# EAGLE design Payload_Power_Board (EAGLE 9.5.1)
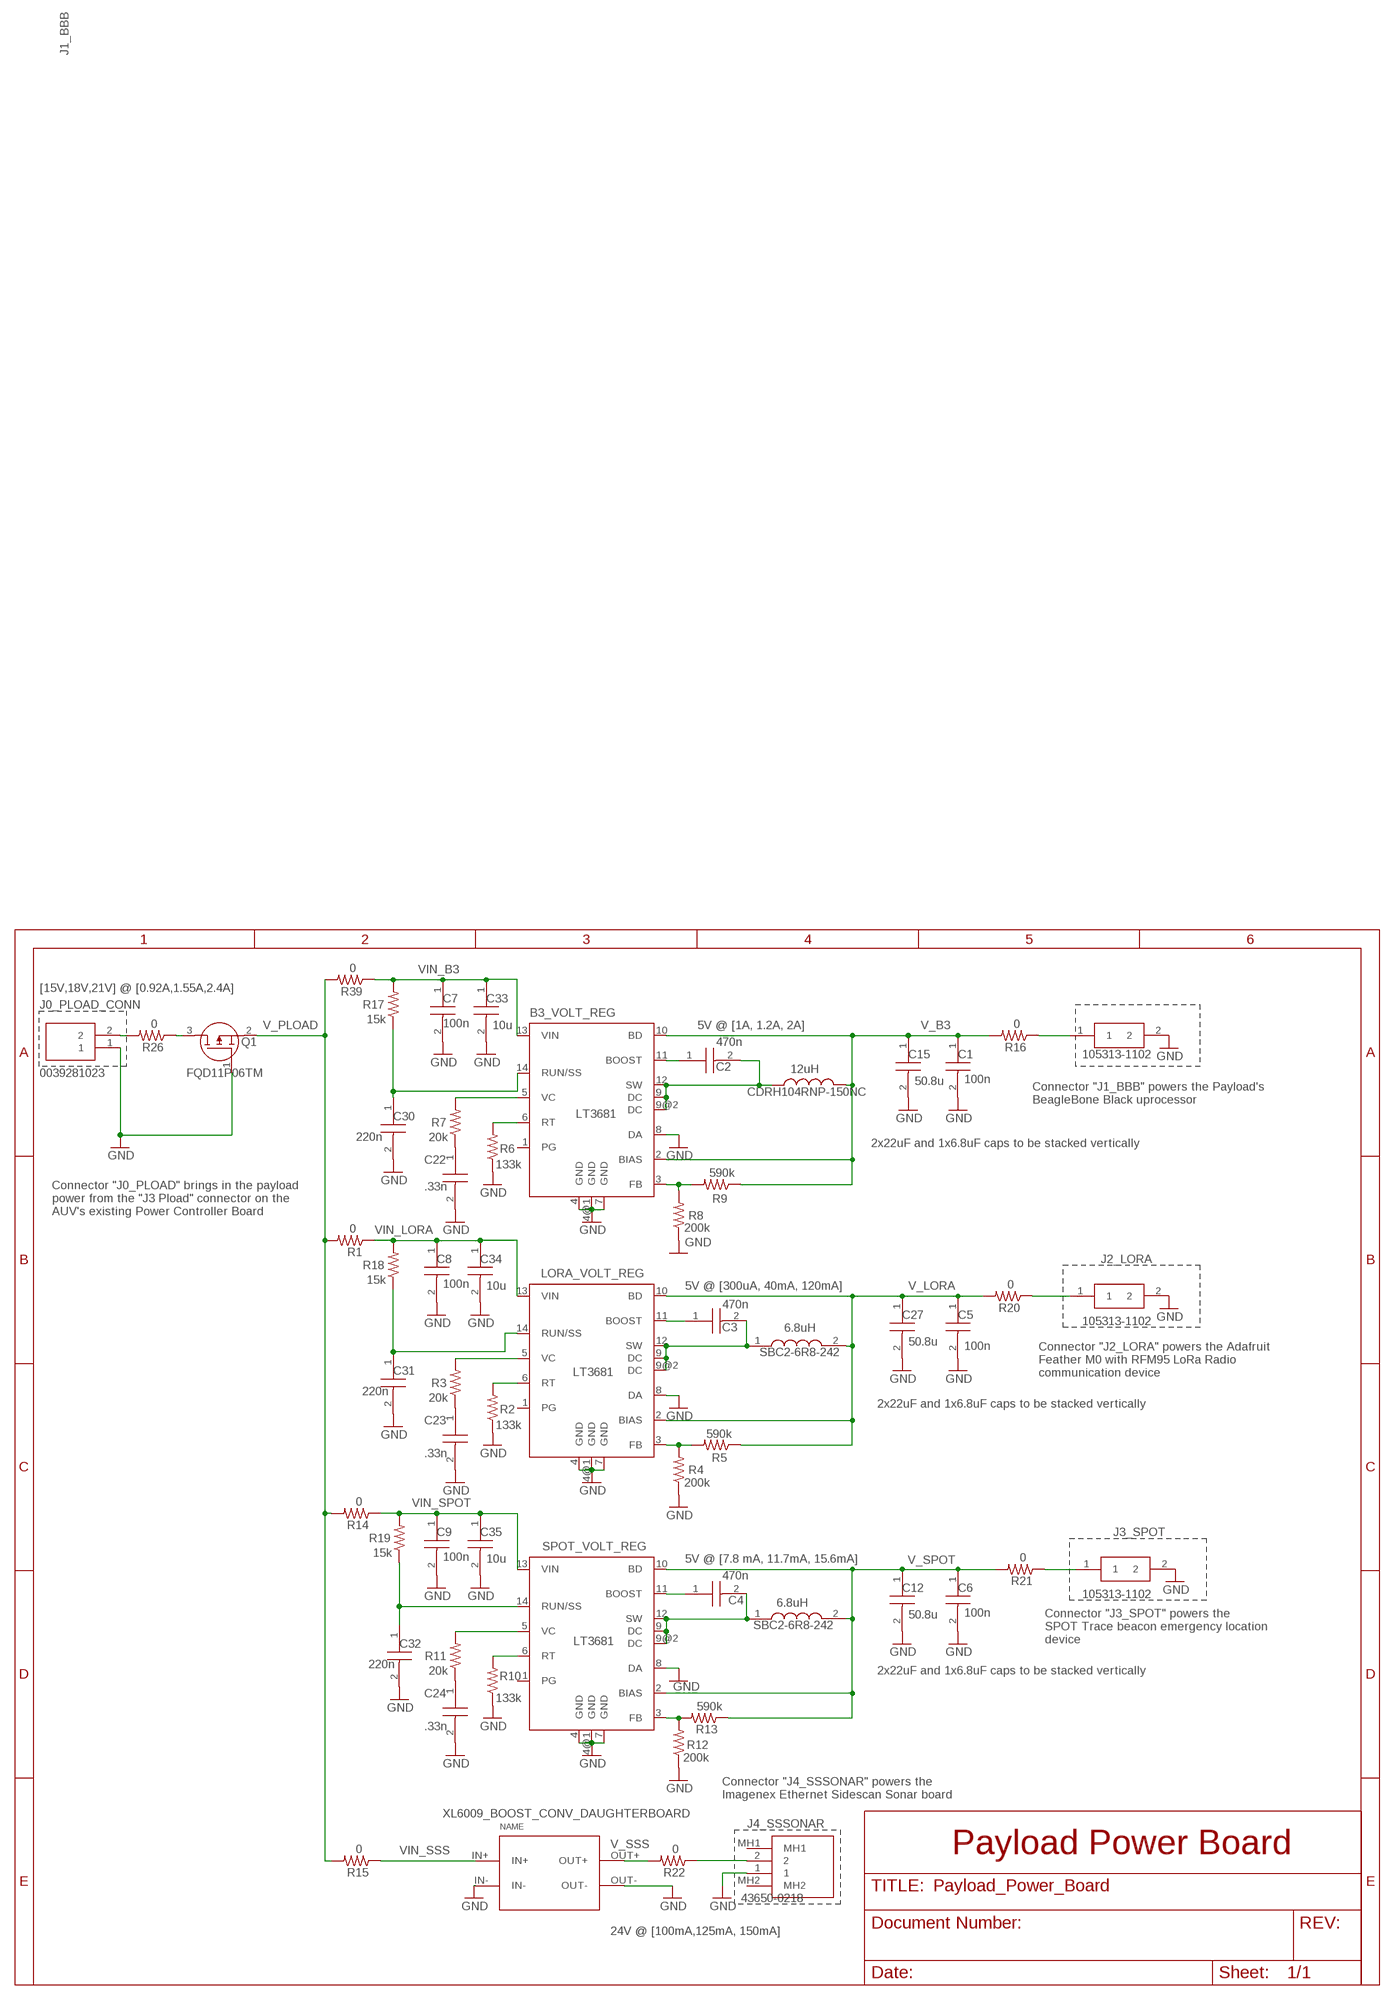
[diagram p0: schematic, sheet 1]

## Parts
B3_VOLT_REG  LT3681  [DFN14-4X3DE]
C1  100n  06033C104KAT4A  [CAPC1608X90N]
C2  470n  06033C474JAT2A  [CAPC1608X90N]
C3  470n  06033C474JAT2A  [CAPC1608X90N]
C4  470n  06033C474JAT2A  [CAPC1608X90N]
C5  100n  06033C104KAT4A  [CAPC1608X90N]
C6  100n  06033C104KAT4A  [CAPC1608X90N]
C7  100n  06031C104KAT2A  [CAPC1608X90N]
C8  100n  06031C104KAT2A  [CAPC1608X90N]
C9  100n  06031C104KAT2A  [CAPC1608X90N]
C12  50.8u  12103C226KAT2A  [CAPC3225X279N]
C15  50.8u  12103C226KAT2A  [CAPC3225X279N]
C22  .33n  08053C334KAT2A  [CAPC2012X140N]
C23  .33n  08053C334KAT2A  [CAPC2012X140N]
C24  .33n  08053C334KAT2A  [CAPC2012X140N]
C27  50.8u  12103C226KAT2A  [CAPC3225X279N]
C30  220n  08051C224KAT2A  [CAPC2012X140N]
C31  220n  08051C224KAT2A  [CAPC2012X140N]
C32  220n  08051C224KAT2A  [CAPC2012X140N]
C33  10u  22201C106KAT2A  [CAPC5750X279N]
C34  10u  22201C106KAT2A  [CAPC5750X279N]
C35  10u  22201C106KAT2A  [CAPC5750X279N]
INDUCTOR_3  CDRH104RNP-150NC  [INDPM102100X400N]
J0_PLOAD_CONN  0039281023  [SHDR2W145P0X550_1X2_960X540X13]
J1_BBB  105313-1102  [1053131102]
J2_LORA  105313-1102  [1053131102]
J3_SPOT  105313-1102  [1053131102]
J4_SSSONAR  43650-0218  [436500218]
L4  SBC2-6R8-242  [SBC26R8242]
L5  SBC2-6R8-242  [SBC26R8242]
LORA_VOLT_REG  LT3681  [DFN14-4X3DE]
Q1  FQD11P06TM  [DPAK3-CASE-369AS]
R1  0  R-US_0207/2V  [0207/2V]
R2  133k  R-US_R0603  [R0603]
R3  20k  R-US_R0603  [R0603]
R4  200k  R-US_R0603  [R0603]
R5  590k  R-US_R0603  [R0603]
R6  133k  R-US_R0603  [R0603]
R7  20k  R-US_R0603  [R0603]
R8  200k  R-US_R0603  [R0603]
R9  590k  R-US_R0603  [R0603]
R10  133k  R-US_R0603  [R0603]
R11  20k  R-US_R0603  [R0603]
R12  200k  R-US_R0603  [R0603]
R13  590k  R-US_R0603  [R0603]
R14  0  R-US_0207/2V  [0207/2V]
R15  0  R-US_0207/2V  [0207/2V]
R16  0  R-US_0207/2V  [0207/2V]
R17  15k  R-US_R0603  [R0603]
R18  15k  R-US_R0603  [R0603]
R19  15k  R-US_R0603  [R0603]
R20  0  R-US_0207/2V  [0207/2V]
R21  0  R-US_0207/2V  [0207/2V]
R22  0  R-US_0207/2V  [0207/2V]
R26  0  R-US_0207/2V  [0207/2V]
R39  0  R-US_0207/2V  [0207/2V]
SPOT_VOLT_REG  LT3681  [DFN14-4X3DE]
XL6009_BOOST_CONV_DAUGHTERBOARD  XL6009  CP8-ADJ  [CP8-ADJ]

## Nets
CBOOST_B3: B3_VOLT_REG.11(BOOST) C2.1
CBOOST_LORA: C3.1 LORA_VOLT_REG.11(BOOST)
CBOOST_SPOT: C4.1 SPOT_VOLT_REG.11(BOOST)
FB_B3: B3_VOLT_REG.3(FB) R8.2 R9.2
FB_LORA: LORA_VOLT_REG.3(FB) R4.2 R5.2
FB_SPOT: R12.2 R13.2 SPOT_VOLT_REG.3(FB)
GND: B3_VOLT_REG.4(GND) B3_VOLT_REG.4@1(GND) B3_VOLT_REG.7(GND) B3_VOLT_REG.8(DA) C1.2 C5.2 C6.2 C7.2 C8.2 C9.2 C12.2 C15.2 C22.2 C23.2 C24.2 C27.2 C30.2 C31.2 C32.2 C33.2 C34.2 C35.2 J0_PLOAD_CONN.1 J1_BBB.2 J2_LORA.2 J3_SPOT.2 J4_SSSONAR.1 LORA_VOLT_REG.4(GND) LORA_VOLT_REG.4@1(GND) LORA_VOLT_REG.7(GND) LORA_VOLT_REG.8(DA) Q1.1(G) R2.1 R4.1 R6.1 R8.1 R10.1 R12.1 SPOT_VOLT_REG.4(GND) SPOT_VOLT_REG.4@1(GND) SPOT_VOLT_REG.7(GND) SPOT_VOLT_REG.8(DA) XL6009_BOOST_CONV_DAUGHTERBOARD.IN- XL6009_BOOST_CONV_DAUGHTERBOARD.OUT-
N$1: C22.1 R7.1
N$2: C23.1 R3.1
N$4: C24.1 R11.1
RT_B3: B3_VOLT_REG.6(RT) R6.2
RT_LORA: LORA_VOLT_REG.6(RT) R2.2
RT_SPOT: R10.2 SPOT_VOLT_REG.6(RT)
RUN/SS_B3: B3_VOLT_REG.14(RUN/SS) C30.1 R17.1
RUN/SS_LORA: C31.1 LORA_VOLT_REG.14(RUN/SS) R18.1
RUN/SS_SPOT: C32.1 R19.1 SPOT_VOLT_REG.14(RUN/SS)
SW_B3: B3_VOLT_REG.9(DC) B3_VOLT_REG.9@2(DC) B3_VOLT_REG.12(SW) C2.2 INDUCTOR_3.1
SW_LORA: C3.2 L5.1 LORA_VOLT_REG.9(DC) LORA_VOLT_REG.9@2(DC) LORA_VOLT_REG.12(SW)
SW_SPOT: C4.2 L4.1 SPOT_VOLT_REG.9(DC) SPOT_VOLT_REG.9@2(DC) SPOT_VOLT_REG.12(SW)
V_B3: B3_VOLT_REG.2(BIAS) B3_VOLT_REG.10(BD) C1.1 C15.1 INDUCTOR_3.2 R9.1 R16.2
V_B31: J1_BBB.1 R16.1
V_LORA: C5.1 C27.1 L5.2 LORA_VOLT_REG.2(BIAS) LORA_VOLT_REG.10(BD) R5.1 R20.2
V_LORA1: J2_LORA.1 R20.1
V_PLOAD: Q1.2(S) R1.2 R14.2 R15.2 R39.2
V_PLOAD0: Q1.3(D) R26.1
V_PLOAD00: J0_PLOAD_CONN.2 R26.2
V_SPOT: C6.1 C12.1 L4.2 R13.1 R21.2 SPOT_VOLT_REG.2(BIAS) SPOT_VOLT_REG.10(BD)
V_SPOT1: J3_SPOT.1 R21.1
V_SSS: R22.2 XL6009_BOOST_CONV_DAUGHTERBOARD.OUT+
V_SSS1: J4_SSSONAR.2 R22.1
VC_B3: B3_VOLT_REG.5(VC) R7.2
VC_LORA: LORA_VOLT_REG.5(VC) R3.2
VC_SPOT: R11.2 SPOT_VOLT_REG.5(VC)
VIN_B3: B3_VOLT_REG.13(VIN) C7.1 C33.1 R17.2 R39.1
VIN_LORA: C8.1 C34.1 LORA_VOLT_REG.13(VIN) R1.1 R18.2
VIN_SPOT: C9.1 C35.1 R14.1 R19.2 SPOT_VOLT_REG.13(VIN)
VIN_SSS: R15.1 XL6009_BOOST_CONV_DAUGHTERBOARD.IN+
Unconnected: B3_VOLT_REG.1(PG) J4_SSSONAR.MH1 J4_SSSONAR.MH2 LORA_VOLT_REG.1(PG) SPOT_VOLT_REG.1(PG)

## Notes on the sheet
- [15V,18V,21V] @ [0.92A,1.55A,2.4A]
- 10u | 5V @ [1A, 1.2A, 2A]
- 12uH
- 50.8u
- Connector "J1_BBB" powers the Payload's
  BeagleBone Black uprocessor
- 220n
- 2x22uF and 1x6.8uF caps to be stacked vertically
- .33n
- Connector "J0_PLOAD" brings in the payload
  power from the "J3 Pload" connector on the 
  AUV's existing Power Controller Board
- 10u | 5V @ [300uA, 40mA, 120mA]
- 470n
- 6.8uH
- 50.8u
- Connector "J2_LORA" powers the Adafruit
  Feather M0 with RFM95 LoRa Radio 
  communication device
- 220n
- 2x22uF and 1x6.8uF caps to be stacked vertically
- .33n
- 10u | 5V @ [7.8 mA, 11.7mA, 15.6mA]
- 6.8uH
- 50.8u
- Connector "J3_SPOT" powers the
  SPOT Trace beacon emergency location
  device
- 220n
- 2x22uF and 1x6.8uF caps to be stacked vertically
- .33n
- Connector "J4_SSSONAR" powers the
  Imagenex Ethernet Sidescan Sonar board
- XL6009_BOOST_CONV_DAUGHTERBOARD
- Payload Power Board
- 24V @ [100mA,125mA, 150mA]

## Library data of the parts
B3_VOLT_REG LORA_VOLT_REG SPOT_VOLT_REG = linear-technology:LT3681: 36V, 2A, 2.8MHz Step-Down Switching Regulator with Integrated Power Schottky Diode Source: http://www.linear.com/pc/downloadDocument.do?navId=H0,C1,C1003,C1042,C1032,C1064,P38040,D25144; MPN: LT3681EDE#PBF; OC_FARNELL: 1627603; OC_NEWARK: 57M8550
C1 C5 C6 = 06033C104KAT4A:06033C104KAT4A: Multilayer Ceramic Capacitors MLCC - SMD/SMT 25volts 0.1uF 10% X7R Source: Datasheet <http://www.mouser.com/catalog/supplier/library/pdf/AVXSurfaceMountCeramic.pdf>; DESCRIPTION: Multilayer Ceramic Capacitors MLCC - SMD/SMT 25volts 0.1uF 10% X7R; HEIGHT: 0.9mm; MANUFACTURER_NAME: AVX; MANUFACTURER_PART_NUMBER: 06033C104KAT4A; MOUSER_PART_NUMBER: 581-06033C104KAT4A; MOUSER_PRICE-STOCK: https://www.mouser.com/Search/Refine.aspx?Keyword=581-06033C104KAT4A
C2-C4 = 06033C474JAT2A:06033C474JAT2A: Multilayer Ceramic Capacitors MLCC - SMD/SMT 25V 470nF X7R 0603 +5% Source: Datasheet <https://componentsearchengine.com/Datasheets/1/06031A100FAT2A.pdf>; DESCRIPTION: Multilayer Ceramic Capacitors MLCC - SMD/SMT 25V 470nF X7R 0603 +5%; HEIGHT: 0.9mm; MANUFACTURER_NAME: AVX; MANUFACTURER_PART_NUMBER: 06033C474JAT2A; MOUSER_PART_NUMBER: 581-06033C474JAT2A; MOUSER_PRICE-STOCK: https://www.mouser.com/Search/Refine.aspx?Keyword=581-06033C474JAT2A
C7-C9 = 06031C104KAT2A:06031C104KAT2A: AVX - 06031C104KAT2A - CAP, MLCC, X7R, 0.1UF, 100V, 0603 Source: Datasheet <https://componentsearchengine.com/Datasheets/1/06031A100FAT2A.pdf>; DESCRIPTION: AVX - 06031C104KAT2A - CAP, MLCC, X7R, 0.1UF, 100V, 0603; HEIGHT: 0.9mm; MANUFACTURER_NAME: AVX; MANUFACTURER_PART_NUMBER: 06031C104KAT2A; MOUSER_PART_NUMBER: 581-06031C104KAT2A; MOUSER_PRICE-STOCK: https://www.mouser.com/Search/Refine.aspx?Keyword=581-06031C104KAT2A
C12 C15 C27 = 12103C226KAT2A:12103C226KAT2A: Multilayer Ceramic Capacitors MLCC - SMD/SMT 25V 22uF X7R 1210 0.1 Source: Datasheet <https://componentsearchengine.com/Datasheets/1/12103C226KAT2A.pdf>; DESCRIPTION: Multilayer Ceramic Capacitors MLCC - SMD/SMT 25V 22uF X7R 1210 0.1; HEIGHT: 2.79mm; MANUFACTURER_NAME: AVX; MANUFACTURER_PART_NUMBER: 12103C226KAT2A; MOUSER_PART_NUMBER: 581-12103C226KAT2A; MOUSER_PRICE-STOCK: https://www.mouser.com/Search/Refine.aspx?Keyword=581-12103C226KAT2A
C22-C24 = 08053C334KAT2A:08053C334KAT2A: AVX 0805 Standard 0.33uF Ceramic Multilayer Capacitor, 25 V dc, +125 Source: Datasheet <http://datasheets.avx.com/X7RDielectric.pdf>; DESCRIPTION: AVX 0805 Standard 0.33uF Ceramic Multilayer Capacitor, 25 V dc, +125; HEIGHT: 1.4mm; MANUFACTURER_NAME: AVX; MANUFACTURER_PART_NUMBER: 08053C334KAT2A; MOUSER_PART_NUMBER: 581-08053C334KAT2A; MOUSER_PRICE-STOCK: https://www.mouser.com/Search/Refine.aspx?Keyword=581-08053C334KAT2A; RS_PART_NUMBER: 1747387; RS_PRICE-STOCK: http://uk.rs-online.com/web/p/products/1747387
C30-C32 = 08051C224KAT2A:08051C224KAT2A: Cap Ceramic 0.22uF 100V X7R 10% Pad SMD 0805 125C T/R Source: Datasheet <https://www.mouser.com/datasheet/2/40/X7RDielectric-777024.pdf>; DESCRIPTION: Cap Ceramic 0.22uF 100V X7R 10% Pad SMD 0805 125C T/R; HEIGHT: 1.4mm; MANUFACTURER_NAME: AVX; MANUFACTURER_PART_NUMBER: 08051C224KAT2A; MOUSER_PART_NUMBER: 581-08051C224KAT2A; MOUSER_PRICE-STOCK: https://www.mouser.com/Search/Refine.aspx?Keyword=581-08051C224KAT2A
C33-C35 = 22201C106KAT2A:22201C106KAT2A: Cap Ceramic 10uF 100V X7R 10% Pad SMD 2220 125C T/R Source: Datasheet <https://www.mouser.com/datasheet/2/40/X7RDielectric-777024.pdf>; DESCRIPTION: Cap Ceramic 10uF 100V X7R 10% Pad SMD 2220 125C T/R; HEIGHT: 2.79mm; MANUFACTURER_NAME: AVX; MANUFACTURER_PART_NUMBER: 22201C106KAT2A; MOUSER_PART_NUMBER: 581-22201C106KAT2A; MOUSER_PRICE-STOCK: https://www.mouser.com/Search/Refine.aspx?Keyword=581-22201C106KAT2A
INDUCTOR_3 = CDRH104RNP-150NC:CDRH104RNP-150NC: Fixed Inductors 15uH 3.1A Source: Datasheet <http://products.sumida.com/products/pdf/CDRH104R.pdf>; DESCRIPTION: Fixed Inductors 15uH 3.1A; HEIGHT: 4mm; MANUFACTURER_NAME: Sumida; MANUFACTURER_PART_NUMBER: CDRH104RNP-150NC; MOUSER_PART_NUMBER: 851-CDRH104RNP-150NC; MOUSER_PRICE-STOCK: https://www.mouser.com/Search/Refine.aspx?Keyword=851-CDRH104RNP-150NC
J0_PLOAD_CONN = 0039281023:0039281023: Mini-Fit Jr. Vertical Header, 4.20mm Pitch, Dual Row, 2 Circuits, without Snap-in Plastic Peg PCB Lock, Tin, Natural Source: Datasheet <http://www.molex.com/webdocs/datasheets/pdf/en-us//0039281023_PCB_HEADERS.pdf>; DESCRIPTION: Mini-Fit Jr. Vertical Header, 4.20mm Pitch, Dual Row, 2 Circuits, without Snap-in Plastic Peg PCB Lock, Tin, Natural; HEIGHT: 13.1mm; MANUFACTURER_NAME: Molex; MANUFACTURER_PART_NUMBER: 0039281023; MOUSER_PART_NUMBER: N/A; MOUSER_PRICE-STOCK: https://www.mouser.com/Search/Refine.aspx?Keyword=N%2FA
J1_BBB J2_LORA J3_SPOT = 105313-1102:105313-1102: Molex Nano-Fit 105313, 2.5mm Pitch, 2 Way, 1 Row, Right Angle PCB Header, Through Hole Source: Datasheet <https://www.molex.com/molex/products/datasheet.jsp?part=active/1053131102_PCB_HEADERS.xml&channel=Products&Lang=en-US>; DESCRIPTION: Molex Nano-Fit 105313, 2.5mm Pitch, 2 Way, 1 Row, Right Angle PCB Header, Through Hole; HEIGHT: 6.84mm; MANUFACTURER_NAME: Molex; MANUFACTURER_PART_NUMBER: 105313-1102; MOUSER_PART_NUMBER: 538-105313-1102; MOUSER_PRICE-STOCK: https://www.mouser.com/Search/Refine.aspx?Keyword=538-105313-1102; RS_PART_NUMBER: 1623686; RS_PRICE-STOCK: http://uk.rs-online.com/web/p/products/1623686
J4_SSSONAR = 43650-0218:43650-0218: Micro-Fit 3.0 Vertical Header, 3.00mm Pitch, Single Row, Circuits, with PCB Polarizing Peg, Gold, Glow-Wire Capable, Black Source: Datasheet <https://www.molex.com/pdm_docs/sd/436500716_sd.pdf>; DESCRIPTION: Micro-Fit 3.0 Vertical Header, 3.00mm Pitch, Single Row, Circuits, with PCB Polarizing Peg, Gold, Glow-Wire Capable, Black; HEIGHT: 10.15mm; MANUFACTURER_NAME: Molex; MANUFACTURER_PART_NUMBER: 43650-0218; MOUSER_PART_NUMBER: 538-43650-0218; MOUSER_PRICE-STOCK: https://www.mouser.com/Search/Refine.aspx?Keyword=538-43650-0218; RS_PART_NUMBER: 6704705P; RS_PRICE-STOCK: http://uk.rs-online.com/web/p/products/6704705P
L4 L5 = SBC2-6R8-242:SBC2-6R8-242: Fixed Inductors 6.8uH 20% 2.4A DCR=50mOhms Source: Datasheet <https://www.mouser.com/datasheet/2/212/KEM_L9007_SBC-1102894.pdf>; DESCRIPTION: Fixed Inductors 6.8uH 20% 2.4A DCR=50mOhms; HEIGHT: 8mm; MANUFACTURER_NAME: Kemet; MANUFACTURER_PART_NUMBER: SBC2-6R8-242; MOUSER_PART_NUMBER: 80-SBC2-6R8-242; MOUSER_PRICE-STOCK: https://www.mouser.com/Search/Refine.aspx?Keyword=80-SBC2-6R8-242
Q1 = FQD11P06TM:FQD11P06TM: FQD11P06TM P-Channel MOSFET, 9.4 A, 60 V, 3-Pin DPAK ON Semiconductor Source: Datasheet <https://www.onsemi.com/pub/Collateral/FQU11P06-D.pdf>; DESCRIPTION: FQD11P06TM P-Channel MOSFET, 9.4 A, 60 V, 3-Pin DPAK ON Semiconductor; HEIGHT: mm; MANUFACTURER_NAME: ON Semiconductor; MANUFACTURER_PART_NUMBER: FQD11P06TM; MOUSER_PART_NUMBER: 512-FQD11P06TM; MOUSER_PRICE-STOCK: https://www.mouser.com/Search/Refine.aspx?Keyword=512-FQD11P06TM; RS_PART_NUMBER: 6710949P; RS_PRICE-STOCK: http://uk.rs-online.com/web/p/products/6710949P
R1 R14-R16 R20-R22 R26 R39 = rcl:R-US_: RESISTOR, American symbol; DESC: RES SMD 10K OHM 1% 1/8W 0805; MFR: Yageo; MPN: RC0805FR-0710KL; SPICEPREFIX: R
R2-R13 R17-R19 = rcl:R-US_: RESISTOR, American symbol; SPICEPREFIX: R
XL6009_BOOST_CONV_DAUGHTERBOARD = userlib:CP8-ADJ: Voltage regulator IN: 7-35V OUT: ADJ

## Board
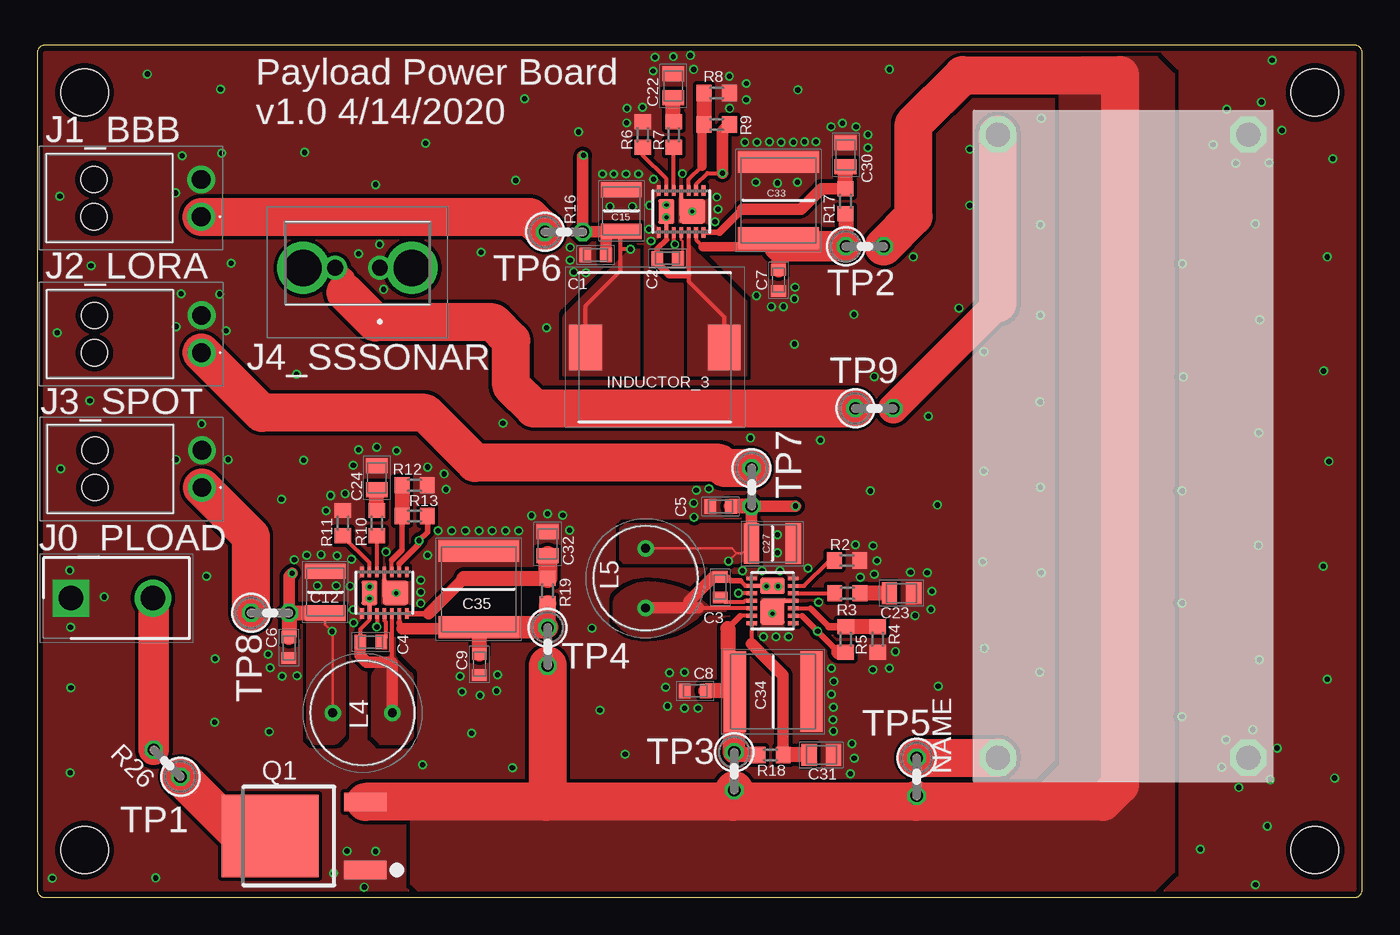
[diagram p1: board, top side]
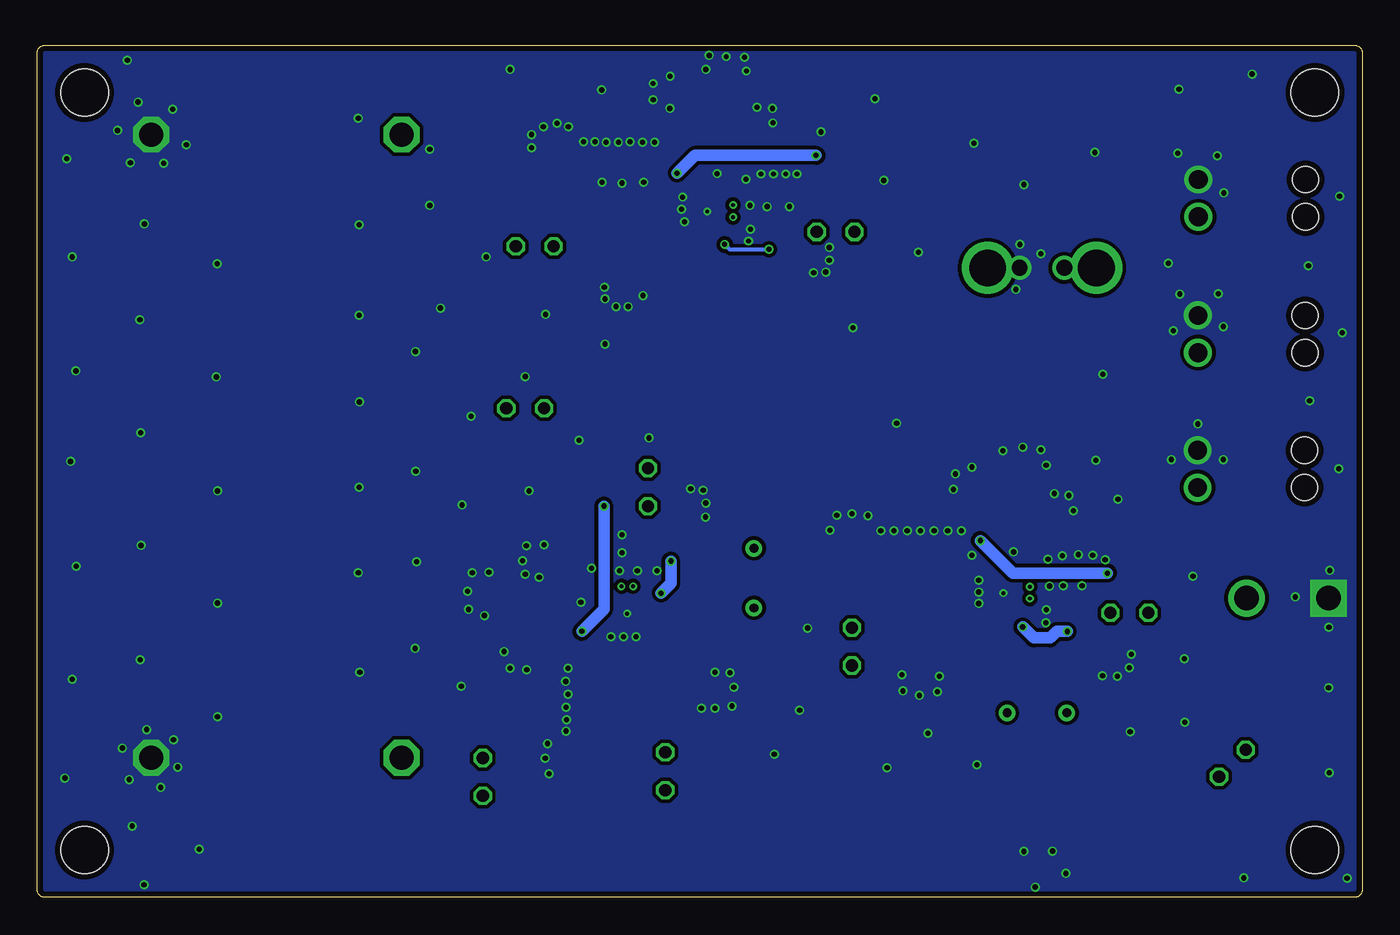
[diagram p2: board, bottom side, seen from below]

Size 88.9 x 57.15 mm. Coordinates in mm from the lower left corner, seen from the top.
Outline: 88.39,57.15 0.51,57.15 arc90 0,56.64 0,0.51 arc90 0.51,0 88.39,0 arc90 88.9,0.51 88.9,56.64 arc90 88.39,57.15
Copper layers (1*16): Top 0.035559375mm / dielectric 1.6mm / Bottom 0.035559375mm
Design rules "oshpark-2layer": minimum track width 6mil, minimum drill 10mil, track to track 6mil, track to pad 6mil, pad to pad 6mil, via to via 6mil, smd to smd 6mil, copper to edge 15mil, drill to drill 6mil, minimum pad ring 5mil, minimum via ring 5mil, stop-mask expansion 2.5mil, vias tented up to drill 0mil, thermal gap 10mil
Holes 3.17 mm at 85.72,3.17 85.72,53.98 3.17,53.98 3.17,3.17

### Footprints (pad centres in the part's own frame; a part is rotated, then mirrored left to right if it is on the bottom)
DFN14-4X3DE = smd 0.25 x 0.7: 1 -1.5,-1.4; 2 -1,-1.4; 3 -0.5,-1.4; 5 0.5,-1.4; 6 1,-1.4; 7 1.5,-1.4; 8 1.5,1.4; 10 0.5,1.4; 11 0,1.4; 12 -0.5,1.4; 13 -1,1.4; 14 -1.5,1.4 | smd 0.25 x 2: 4 0,-0.75; 9 1,0.75 | smd 1.75 x 1.65: 4@1 -0.75,0 | smd 1.07 x 1.65: 9@2 1,0
CAPC1608X90N = smd 0.78 x 0.99: 1 -0.7,0; 2 0.7,0
CAPC3225X279N = smd 1.02 x 2.72: 1 -1.4,0; 2 1.4,0
CAPC2012X140N = smd 1.02 x 1.47: 1 -0.81,0; 2 0.81,0
CAPC5750X279N = smd 1.47 x 5.41: 1 -2.57,0; 2 2.57,0
INDPM102100X400N = smd 2.2 x 3.05: 1 -4.65,0; 2 4.65,0
SHDR2W145P0X550_1X2_960X540X13 = drill 1.65 pad 2.475 square: 1 0,0 | drill 1.65 pad 2.475: 2 -5.5,0
1053131102 = drill 1.25 pad 1.875: 1 0,0; 2 -2.5,0 | hole 1.75: 0,-7.18; -2.5,-7.18
436500218 = drill 1.07 pad 1.3: 1 0,0; 2 -3,0 | drill 2.46 pad 2.8: MH1 -5.15,0; MH2 2.15,0
SBC26R8242 = drill 0.6 pad 1.1: 1 0,0; 2 0,-4
DPAK3-CASE-369AS = smd 1.25 x 2.85: 1 -2.28,-6.4; 2 2.28,-6.4 | smd 5.55 x 6.5: 3 0,0
0207/2V = drill 0.813 octagon: 1 -1.27,0; 2 1.27,0
R0603 = smd 1 x 1.1: 1 -0.85,0; 2 0.85,0
CP8-ADJ = drill 1.6 octagon: IN+ -21.81,7.05; IN- -21.81,-9.75; OUT+ 19.99,7.05; OUT- 19.99,-9.75

### Placement (x,y rotation side)
B3_VOLT_REG  43.21,46 180 top
C1  37.47,43.08 180 top
C2  42.29,42.85 180 top
C3  45.82,20.8 90 top
C4  22.38,17.12 180 top
C5  45.85,26.21 180 top
C6  16.89,16.74 270 top
C7  49.73,41.38 270 top
C8  44.15,13.84 180 top
C9  29.67,15.62 270 top
C12  19.33,20.47 90 top
C15  39.19,46.05 90 top
C22  42.67,54.43 90 top
C23  57.99,20.4 0 top
C24  22.78,28.14 90 top
C27  49.33,23.72 0 top
C30  54.23,49.81 90 top
C31  52.6,9.55 0 top
C32  34.24,23.72 90 top
C33  49.73,46.76 90 top
C34  49.38,13.79 0 top
C35  29.62,20.68 90 top
INDUCTOR_3  41.44,36.89 180 top
J0_PLOAD_CONN  2.26,20.07 180 top
J1_BBB  11,45.64 270 top
J2_LORA  11.02,36.53 270 top
J3_SPOT  11.05,27.48 270 top
J4_SSSONAR  22.99,42.21 0 top
L4  23.83,12.37 270 top
L5  40.82,19.41 180 top
LORA_VOLT_REG  49.33,19.89 90 top
Q1  15.62,4.11 90 top
R1  46.76,8.46 270 top
R2  54.33,22.58 180 top
R3  54.36,20.4 180 top
R4  56.39,17.3 90 top
R5  54.25,17.3 90 top
R6  40.61,51.16 270 top
R7  42.7,51.16 270 top
R8  45.59,53.95 180 top
R9  45.59,51.84 180 top
R10  20.5,25.1 270 top
R11  22.78,25.1 270 top
R12  25.32,27.64 180 top
R13  25.32,25.58 180 top
R14  34.24,16.81 270 top
R15  59,8.08 270 top
R16  35.33,44.63 0 top
R17  54.23,46.69 270 top
R18  49.2,9.55 180 top
R19  34.24,20.55 270 top
R20  47.93,27.51 270 top
R21  15.62,19.08 0 top
R22  56.16,32.79 0 top
R26  8.71,8.99 135 top
R39  55.52,43.66 0 top
SPOT_VOLT_REG  23.29,20.42 180 top
XL6009_BOOST_CONV_DAUGHTERBOARD  71.5,31.17 90 top

### Tracks (layer width: path | path; a pad name or v marks a point on that pad's centre or on a via)
CBOOST_B3
  Top 0.152: B3_VOLT_REG.11 43.2,44.1 43.3,44.01 43.3,43.16 C2.1
CBOOST_LORA
  Top 0.254: LORA_VOLT_REG.11 47.48,19.89 47.39,19.8 46.13,19.8 C3.1
CBOOST_SPOT
  Top 0.254: SPOT_VOLT_REG.11 23.29,18.55 23.39,18.46 23.39,17.43 C4.1
FB_B3
  Top 0.254: B3_VOLT_REG.3 43.7,48.15 44.6,49.05
  Top 0.635: R9.2 44.6,51.7 44.6,49.05
  Top 1.016: R8.2 R9.2
FB_LORA
  Top 0.254: LORA_VOLT_REG.3 51.88,19.39
  Top 0.381: 51.88,19.39 53.12,18.15
  Top 0.508: 53.12,18.15 R5.2
  Top 1.016: R4.2 R5.2
FB_SPOT
  Top 0.254: SPOT_VOLT_REG.3 23.79,22.62
  Top 0.381: R13.2 24.47,23.3 23.79,22.62
  Top 1.016: R12.2 R13.2
GND  (via drill 0.25, 0.33, 0.35)
  Top 0.152: SPOT_VOLT_REG.4@1 SPOT_VOLT_REG.4
  other vias: 52.25,50.67 51.49,50.67 50.72,50.65 49.91,50.65 49.12,50.67 48.29,50.65 47.47,50.65 40.34,48.51 38.68,48.51 37.92,48.51 39.5,48.51 43.28,48.54 45.47,45.31 45.67,46.15 45.59,46.96 47.57,54.58 42.67,56.39 39.55,51.94 40.61,52.98 41.33,55.42 46.43,55.07 54.03,51.92 43.94,46 25.73,19.71 25.73,20.47 25.73,21.26 41.17,44.02 41.35,48.16 54.94,51.69 53.26,51.69 49.25,39.62 50.06,39.62 50.8,40.13 44.04,55.52 35.76,42.72 35.76,43.59 32.31,24.59 31.42,24.59 30.53,24.59 29.64,24.59 28.73,24.59 27.81,24.59 26.9,24.59 35.26,25.63 34.24,25.73 33.17,25.6 23.39,23.16 21.08,22.68 21.23,18.41 50.42,17.48 49.56,17.48 48.72,17.48 49.33,19.02 52.43,19.79 51.71,22.07 47.32,21.89 24.08,20.4 39.57,52.91 39.93,46.33 38.43,46.33 50.85,40.92 41.05,44.81 35.99,41.94 36.8,41.88 22.71,3.07 20.78,3.1 21.95,0.69 54.89,23.65 56.08,23.57 56.34,22.58 58.6,21.79 59.72,21.77 60.02,20.52 59.97,19.3 58.9,18.9 57.58,16.48 57.18,15.37 56.06,15.27 53.42,11.15 53.39,11.91 53.42,12.75 53.29,13.61 53.44,14.48 53.29,15.37 54.56,8.28 54.81,9.32 54.66,10.31 43.43,12.67 42.29,12.83 42.16,14.1 42.42,15.06 43.43,15.09 45.06,27.41 44.22,27.3 44.04,26.44 44.07,25.5 49.66,23.11 49.66,24.31 27.3,28.4 24.1,29.95 22.78,30.2 21.56,30.02 21.21,28.98 20.65,27.08 19.68,26.95 19.38,25.93 20.12,22.91 19.05,22.99 18.08,22.94 17.25,22.63 21.18,19.28 20.07,20.9 18.8,20.9 17.42,14.86 16.43,14.83 15.62,15.39 15.49,16.31 30.89,14.94 30.81,13.84 29.72,13.54 28.5,13.79 28.37,14.83 35.71,24.61 26.19,22.94 41.45,56.34 43.81,56.46 47.57,53.49 51,47.96 49.66,47.9 48.21,47.96 48.64,21.89 27.43,27.36 26.19,28.85 1.52,47.02 9.73,49.73 12.37,49.91 9.3,47.24 9.32,38.28 9.65,40.49 12.24,40.46 12.67,38 3.53,33.3 12.8,29.36 9.32,29.36 2.24,18.11 4.5,20.14 2.26,14.05 19.89,1.6 80.62,7.37 82.73,7.9 83.19,10.01 81.56,11.25 79.76,10.57 79.48,8.74 79.81,52.86 82.14,53.34 83.52,51.44 82.65,49.28 80.42,49.23 78.89,50.47 55.73,51.16 55.73,50.27 46.46,52.91 41.07,46.41 49.83,21.89 55.22,21.46 56.16,21.67 20.98,20.88 44.35,12.67 55.91,27.25 52.55,30.66 60.4,26.31 59.79,32.26 63.5,28.57 67.36,21.77 67.31,45.11 67.36,52.25 67.31,39.04 67.28,33.22 67.31,27.51 67.26,15.09 76.83,42.49 76.89,34.9 76.81,27.25 76.81,19.74 76.81,12.12 78.03,3.23 37.74,12.55 58.78,42.95 62.56,50.16 62.56,46.41 61.85,39.52 56.16,34.92 63.53,36.6 29.77,43.26 47.85,30.81 17.4,35.08 31.24,31.8 81.71,45.16 82.02,38.73 81.97,31.17 81.94,23.6 81.99,15.93 82.52,4.78 81.74,0.84 87.05,8 86.56,14.63 86.28,22.2 86.66,29.24 86.31,35.31 86.56,42.95 86.92,49.53 82.85,56.13 57.18,55.52 51.03,54.15 32.11,48.08 48.26,40.36 50.8,37.11 54.79,39.09 34.16,38.2 63.55,16.69 63.45,22.5 39.45,9.6 37.21,18.06 31.88,8.69 25.86,8.89 29.13,11 2.21,8.36 1.02,1.27 7.95,1.3 11.91,11.73 15.57,11.1 11.94,16 2.18,21.92 11.35,21.54 1.57,28.75 11.02,31.75 16.38,26.7 17.88,29.31 13,42.52 3.61,42.37 1.35,37.87 22.71,47.8 60.45,14.15 32.69,53.57 36.32,51.33 26.06,50.57 7.39,55.22 12.29,54.2 17.93,49.96 21.56,43.15 22.96,43.79 23.24,40.77
  pour Bottom (isolate 0.254, rank 6, no thermals): -0.15,57.53 89.33,57.53 89.33,-0.41 -0.33,-0.41
  pour Top (isolate 0.254, rank 6, no thermals): -0.33,57.53 89.33,57.53 89.33,-0.41 -0.33,-0.41
N$1
  Top 0.254: R7.1 42.67,52.13
  Top 1.016: 42.67,52.13 C22.1
N$2
  Top 1.016: C23.1 R3.1
N$4
  Top 1.016: R11.1 C24.1
RT_B3
  Top 0.254: B3_VOLT_REG.6 42.2,48.19 40.62,49.78 R6.2
RT_LORA
  Top 0.254: LORA_VOLT_REG.6 51.44,20.89 53.14,22.58 R2.2
RT_SPOT
  Top 0.254: SPOT_VOLT_REG.6 22.29,22.44 20.5,24.23 R10.2
RUN/SS_B3
  Top 0.381: B3_VOLT_REG.14 45.77,44.6
  Top 0.508: 45.77,44.6 47.32,46.15
  Top 0.762: 47.32,46.15 51.23,46.15 52.62,47.53 R17.1
  Top 1.016: R17.1 C30.1
RUN/SS_LORA
  Top 0.254: LORA_VOLT_REG.14 47.93,18.26 47.93,17.02
  Top 0.762: R18.1 50.05,14.9 47.93,17.02
  Top 1.016: C31.1 R18.1
RUN/SS_SPOT
  Top 0.381: SPOT_VOLT_REG.14 26.26,19.02
  Top 0.762: 26.26,19.02 28.64,21.4
  Top 1.016: 28.64,21.4 R19.1
  Top 1.27: C32.1 R19.1
SW_B3  (via drill 0.25)
  Top 0.152: 42.2,44.16 42.2,44.11 | C2.2 41.59,42.56 | B3_VOLT_REG.9@2 B3_VOLT_REG.9 v42.2,45.61 v42.22,45.62
  Top 0.254: B3_VOLT_REG.12 43.7,41.83 | 43.7,41.83 43.7,41.31 46.09,38.92 INDUCTOR_3.1 | 43.63,41.76 43.7,41.83 | B3_VOLT_REG.9 42.2,44.16 | B3_VOLT_REG.9@2 v42.2,46.42 v42.22,46.43
  Top 0.381: 42.2,44.11 41.59,43.5 C2.2
  Top 0.508: 43.63,41.76 42.39,41.76 41.59,42.56
  pour Top (isolate 0.254, no thermals): 43.69,35.03 47.55,35.03 47.55,39.98 43.69,43.84
SW_LORA  (via drill 0.25)
  Top 0.152: v49.71,20.85 49.67,20.89 LORA_VOLT_REG.9@2 | LORA_VOLT_REG.9@2 LORA_VOLT_REG.9 | LORA_VOLT_REG.9@2 49.29,20.85 v48.92,20.85
  Top 0.254: LORA_VOLT_REG.12 44.39,19.39 | 44.39,19.39 43.73,19.39 | 44.39,19.39 44.37,19.41 | LORA_VOLT_REG.9 47.51,20.89 47.17,21.23
  Top 0.381: C3.2 46.25,21.5 46.52,21.23 47.17,21.23
  Top 0.762: C3.2 45.36,21.5 43.73,19.87 43.73,19.39 | L5.1 44.37,19.41
  pour Top (isolate 0.254, no thermals): 46.18,19.23 44.99,19.23 arc45 44.63,19.08 arc-45 40.79,17.49 arc-45 38.99,18.23 38.71,18.52 38.71,19.76 arc-45 38.91,20.24 38.94,20.27 arc-45 40.97,21.11 arc-45 45.16,19.38 46.02,19.38
SW_SPOT  (via drill 0.25)
  Top 0.152: SPOT_VOLT_REG.9 v22.29,20.03 v22.3,20.04
  Top 0.254: SPOT_VOLT_REG.12 23.79,15.78 23.79,15.72 | SPOT_VOLT_REG.9 22.29,18.61 21.68,17.99 C4.2 | SPOT_VOLT_REG.9 22.29,20.82 v22.3,20.83 | SPOT_VOLT_REG.9@2 SPOT_VOLT_REG.9
  Top 0.762: 23.79,15.72 23.82,15.69 L4.1 | C4.2 21.68,16.19 22.09,15.78 23.79,15.78
  pour Top (isolate 0.254, no thermals): 23.98,17.37 23.98,16.31 arc45 24.13,15.95 25.05,15.03 arc-45 25.2,14.67 25.2,10.95 arc-45 25.05,10.6 24.74,10.29 23.01,10.29 22.48,10.82 22.48,14.73 arc-45 22.68,15.21 23.83,16.36 23.83,17.22
V_B3  (via drill 0.33)
  Top 0.254: B3_VOLT_REG.2 44.2,47.81 44.96,48.56 v45.97,48.56 | C15.1 39.14,44.6 39.14,43.51 | INDUCTOR_3.2 36.79,39.66 39.14,42.01 39.14,43.51 | B3_VOLT_REG.10 42.7,43.81 42.72,43.79 v42.78,43.79 | v39.8,43.46 39.19,43.46 39.14,43.51 | 36.6,49.71 v36.65,49.76
  Top 0.762: 38.18,44.63 R16.2 36.6,49.71 | 38.18,44.63 39.11,44.63 39.14,44.6 | C1.1 38.16,44.62 38.18,44.63 | v45.97,48.56 45.97,51.37 R9.1
  Bottom 0.254: v42.78,43.79 42.42,43.43 39.83,43.43 v39.8,43.46
  Bottom 0.762: v36.65,49.76 44.78,49.76 v45.97,48.56
  pour Top (isolate 0.254, no thermals): 39.75,43.43 35.45,39.14 arc45 35.31,38.78 35.31,35.03 40.36,35.03 40.36,43.43
V_B31
  Top 2.54: J1_BBB.1 33.05,45.64 R16.1
V_LORA  (via drill 0.35)
  Top 0.152: R20.2 | 46.57,26.24 C5.1 | 47.05,20.39 v47.04,20.4 | 46.91,23.09 47.29,23.09 C27.1 | 46.91,23.09 v46.38,22.55 | L5.2 46.6,23.41 46.91,23.09
  Top 0.254: LORA_VOLT_REG.2 51.32,18.89 | LORA_VOLT_REG.10 47.05,20.39
  Top 0.381: 51.32,18.89 v52.36,17.84 53.76,16.45
  Top 0.762: C27.1 R20.2 | R20.2 v50.88,26.24
  Top 1.016: 53.76,16.45 R5.1 | R20.2 46.57,26.24
  Bottom 0.152: 46.38,21.06 46.38,21.16
  Bottom 0.762: 46.38,21.16 v46.38,22.55 | v52.36,17.84 50.88,19.33 v50.88,26.24 | v47.04,20.4 46.38,21.06
  pour Top (isolate 0.254, no thermals): 48.39,22.43 48.39,25.02 39.42,25.02 39.19,24.79 arc45 39.12,24.62 39.12,22.66 39.35,22.43
V_LORA1
  Top 2.54: R20.1 46.13,28.78 45.77,29.13 29.36,29.13 26.01,32.49 15.06,32.49 J2_LORA.1
V_PLOAD
  Top 2.032: R15.2 59,6.45
  Top 2.54: R39.2 58.8,45.67 58.8,51.84 62.1,55.14 72.64,55.14 72.64,7.54 71.5,6.39 58.95,6.39 | 58.95,6.39 46.71,6.39 | 46.71,6.39 34.16,6.39 | 34.16,6.39 Q1.2 | R14.2 34.24,6.47 34.16,6.39 | R1.2 46.76,6.45 46.71,6.39 | 59,6.45 58.95,6.39
  pour Top (isolate 0.254, no thermals): 25.07,6.65 25.07,0.91 25.58,0.41 74.96,0.41 76.25,1.7 76.25,55.19 75.11,56.34 70.13,56.34 68.61,54.81 68.61,8.92 67.03,7.34 25.76,7.34
V_PLOAD0
  Top 2.54: Q1.3 13.59,4.12 R26.1
V_PLOAD00
  Top 2.032: J0_PLOAD_CONN.2 7.81,20.01 R26.2
V_SPOT  (via drill 0.35)
  Top 0.152: C12.1 19.33,18.29 v19.79,17.83 19.82,17.79 L4.2
  Top 0.254: 25.63,23.95 v25.63,23.93 | SPOT_VOLT_REG.2 24.29,22.36 | SPOT_VOLT_REG.10 22.79,18.14 v22.78,18.14
  Top 0.381: R13.1 26.17,24.5 25.63,23.95 | 24.29,22.36 25.63,23.7 v25.63,23.93
  Top 0.762: C12.1 | R21.2 16.89,21.54 v17.09,21.74
  Top 1.016: C12.1 R21.2 C6.1
  Bottom 0.762: v19.79,17.83 20.5,17.83 20.93,17.4 22.05,17.4 v22.78,18.14 | v17.09,21.74 23.44,21.74 v25.63,23.93
  pour Top (isolate 0.254, no thermals): 20.62,19.53 20.62,11.08 arc-45 20.48,10.72 20.21,10.46 arc-45 19.86,10.31 18.73,10.31 arc-45 18.37,10.46 18.14,10.69 18.14,19.53
V_SPOT1
  Top 2.54: R21.1 14.33,19.1 14.33,24.21 J3_SPOT.1
V_SSS
  Top 2.032: R22.2 64.45,39.81
  Top 2.54: 64.45,39.81 XL6009_BOOST_CONV_DAUGHTERBOARD.OUT+
V_SSS1
  Top 1.27: J4_SSSONAR.2 20.67,41.54 20.67,40.57
  Top 2.54: R22.1 33.33,32.79 31.8,34.31 31.8,37.34 30.58,38.56 22.68,38.56 20.67,40.57
VC_B3
  Top 0.254: B3_VOLT_REG.5 42.7,50.2 R7.2
VC_LORA
  Top 0.254: LORA_VOLT_REG.5 53.5,20.39 R3.2
VC_SPOT
  Top 0.254: SPOT_VOLT_REG.5 22.79,24.24 R11.2
VIN_B3
  Top 0.254: B3_VOLT_REG.13 44.2,44.11 44.68,43.64 | R17.2 54.25,45.81 | 49.76,43.66 49.73,43.64
  Top 0.635: 44.68,43.64 49.73,43.64
  Top 1.016: C33.1 49.73,43.64 C7.1 | 54.25,45.81 R39.1
  Top 2.032: R39.1 49.76,43.66
VIN_LORA
  Top 0.254: 46.76,13.74 C34.1 46.33,13.79 | LORA_VOLT_REG.13 47.18,18.89
  Top 0.381: 47.18,18.89 46.33,18.03
  Top 1.016: 46.33,13.84 C8.1 | 46.33,18.03 46.33,13.84 | 46.33,13.84 46.33,13.79 | R18.2 46.79,9.55 R1.1
  Top 1.524: R1.1 46.76,13.74
VIN_SPOT
  Top 0.254: SPOT_VOLT_REG.13 24.29,18.44 | 29.52,18 C35.1
  Top 0.406: 24.29,18.44 24.48,18
  Top 0.762: 24.48,18 29.52,18 | R14.1 34.22,18.11 34.24,18.13
  Top 1.016: C9.1 29.67,18.05 C35.1
  Top 1.143: 34.24,18.13 R19.2
  Top 1.524: C35.1 34.22,18.11
VIN_SSS
  Top 2.54: R15.1 64.43,9.37 XL6009_BOOST_CONV_DAUGHTERBOARD.IN+

### Text on the board
tPlace: Payload Power Board / v1.0 4/14/2020 | J1_BBB | J2_LORA | TP6 | TP2 | J4_SSSONAR | TP9 | J3_SPOT | TP7 | J0_PLOAD | TP4 | TP8 | TP5 | TP3 | TP1